# EAGLE design DDB Power Supply (EAGLE 8.2.2)
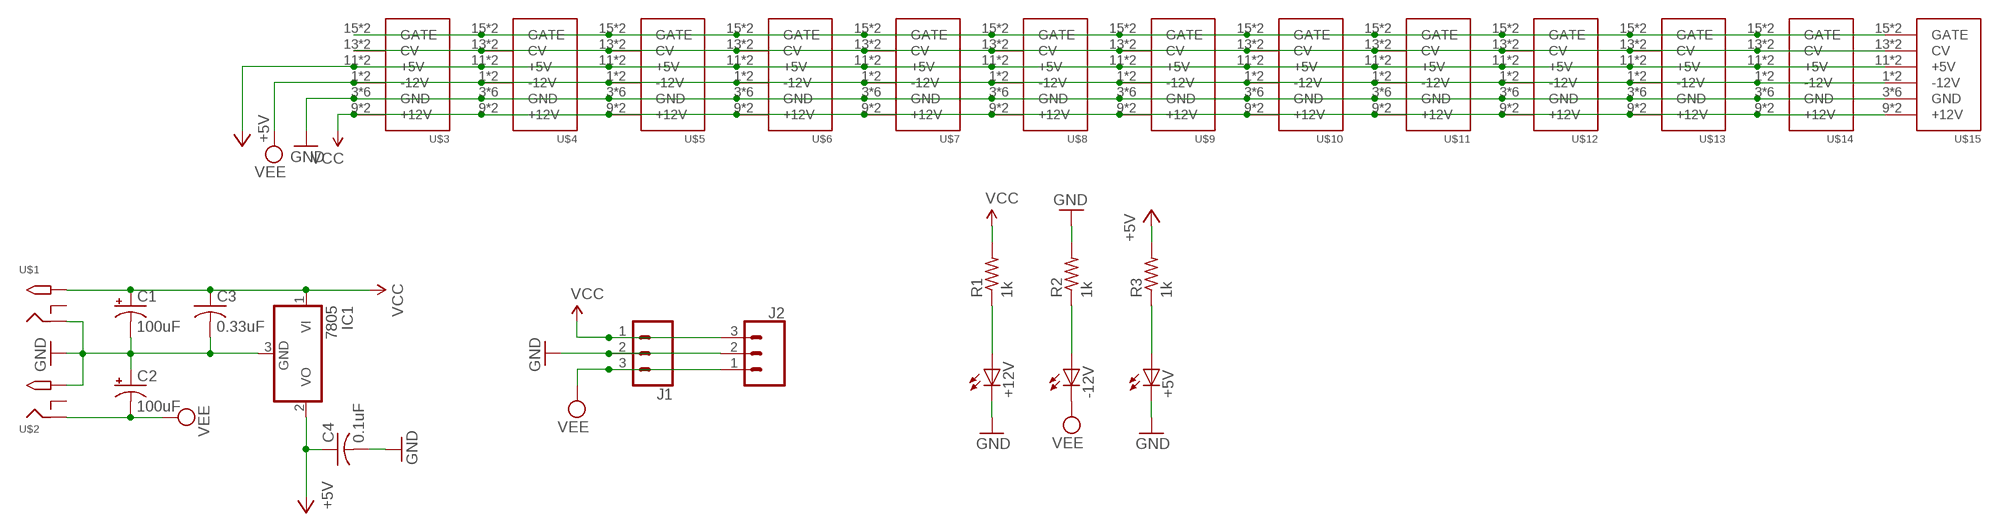
[diagram p0: schematic, sheet 1]

## Parts
+5V  LED3MM  [LED3MM]
+12V  LED3MM  [LED3MM]
-12V  LED3MM  [LED3MM]
C1  100uF  CPOL-USE3.5-8  [E3,5-8]
C2  100uF  CPOL-USE3.5-8  [E3,5-8]
C3  0.33uF  C-USC0805  [C0805]
C4  0.1uF  C-USC0805  [C0805]
IC1  7805  7824DT  [TO252]
J1  CONN_03SCREW  [SCREWTERMINAL-3.5MM-3]
J2  CONN_03SCREW  [SCREWTERMINAL-3.5MM-3]
R1  1k  R-US_R0805  [R0805]
R2  1k  R-US_R0805  [R0805]
R3  1k  R-US_R0805  [R0805]
U$1  2.1MMJACKTHM  [PJ-102A]
U$2  2.1MMJACKTHM  [PJ-102A]
U$3  POWER  [POWER_16]
U$4  POWER  [POWER_16]
U$5  POWER  [POWER_16]
U$6  POWER  [POWER_16]
U$7  POWER  [POWER_16]
U$8  POWER  [POWER_16]
U$9  POWER  [POWER_16]
U$10  POWER  [POWER_16]
U$11  POWER  [POWER_16]
U$12  POWER  [POWER_16]
U$13  POWER  [POWER_16]
U$14  POWER  [POWER_16]
U$15  POWER  [POWER_16]

## Nets
+5V: C4.1 IC1.2(VO) R3.2 U$3.11(+5V) U$3.12(+5V) U$4.11(+5V) U$4.12(+5V) U$5.11(+5V) U$5.12(+5V) U$6.11(+5V) U$6.12(+5V) U$7.11(+5V) U$7.12(+5V) U$8.11(+5V) U$8.12(+5V) U$9.11(+5V) U$9.12(+5V) U$10.11(+5V) U$10.12(+5V) U$11.11(+5V) U$11.12(+5V) U$12.11(+5V) U$12.12(+5V) U$13.11(+5V) U$13.12(+5V) U$14.11(+5V) U$14.12(+5V) U$15.11(+5V) U$15.12(+5V)
GND: +5V.K(C) +12V.K(C) C1.- C2.+ C3.2 C4.2 IC1.3(GND) J1.2 J2.2 R2.2 U$1.RING U$2.TIP U$3.3(GND) U$3.4(GND) U$3.5(GND) U$3.6(GND) U$3.7(GND) U$3.8(GND) U$4.3(GND) U$4.4(GND) U$4.5(GND) U$4.6(GND) U$4.7(GND) U$4.8(GND) U$5.3(GND) U$5.4(GND) U$5.5(GND) U$5.6(GND) U$5.7(GND) U$5.8(GND) U$6.3(GND) U$6.4(GND) U$6.5(GND) U$6.6(GND) U$6.7(GND) U$6.8(GND) U$7.3(GND) U$7.4(GND) U$7.5(GND) U$7.6(GND) U$7.7(GND) U$7.8(GND) U$8.3(GND) U$8.4(GND) U$8.5(GND) U$8.6(GND) U$8.7(GND) U$8.8(GND) U$9.3(GND) U$9.4(GND) U$9.5(GND) U$9.6(GND) U$9.7(GND) U$9.8(GND) U$10.3(GND) U$10.4(GND) U$10.5(GND) U$10.6(GND) U$10.7(GND) U$10.8(GND) U$11.3(GND) U$11.4(GND) U$11.5(GND) U$11.6(GND) U$11.7(GND) U$11.8(GND) U$12.3(GND) U$12.4(GND) U$12.5(GND) U$12.6(GND) U$12.7(GND) U$12.8(GND) U$13.3(GND) U$13.4(GND) U$13.5(GND) U$13.6(GND) U$13.7(GND) U$13.8(GND) U$14.3(GND) U$14.4(GND) U$14.5(GND) U$14.6(GND) U$14.7(GND) U$14.8(GND) U$15.3(GND) U$15.4(GND) U$15.5(GND) U$15.6(GND) U$15.7(GND) U$15.8(GND)
N$1: U$3.15(GATE) U$3.16(GATE) U$4.15(GATE) U$4.16(GATE) U$5.15(GATE) U$5.16(GATE) U$6.15(GATE) U$6.16(GATE) U$7.15(GATE) U$7.16(GATE) U$8.15(GATE) U$8.16(GATE) U$9.15(GATE) U$9.16(GATE) U$10.15(GATE) U$10.16(GATE) U$11.15(GATE) U$11.16(GATE) U$12.15(GATE) U$12.16(GATE) U$13.15(GATE) U$13.16(GATE) U$14.15(GATE) U$14.16(GATE) U$15.15(GATE) U$15.16(GATE)
N$2: U$3.13(CV) U$3.14(CV) U$4.13(CV) U$4.14(CV) U$5.13(CV) U$5.14(CV) U$6.13(CV) U$6.14(CV) U$7.13(CV) U$7.14(CV) U$8.13(CV) U$8.14(CV) U$9.13(CV) U$9.14(CV) U$10.13(CV) U$10.14(CV) U$11.13(CV) U$11.14(CV) U$12.13(CV) U$12.14(CV) U$13.13(CV) U$13.14(CV) U$14.13(CV) U$14.14(CV) U$15.13(CV) U$15.14(CV)
N$3: +5V.A R3.1
N$4: -12V.A R2.1
N$5: +12V.A R1.1
VCC: C1.+ C3.1 IC1.1(VI) J1.1 J2.3 R1.2 U$1.TIP U$3.9(+12V) U$3.10(+12V) U$4.9(+12V) U$4.10(+12V) U$5.9(+12V) U$5.10(+12V) U$6.9(+12V) U$6.10(+12V) U$7.9(+12V) U$7.10(+12V) U$8.9(+12V) U$8.10(+12V) U$9.9(+12V) U$9.10(+12V) U$10.9(+12V) U$10.10(+12V) U$11.9(+12V) U$11.10(+12V) U$12.9(+12V) U$12.10(+12V) U$13.9(+12V) U$13.10(+12V) U$14.9(+12V) U$14.10(+12V) U$15.9(+12V) U$15.10(+12V)
VEE: -12V.K(C) C2.- J1.3 J2.1 U$2.RING U$3.1(-12V) U$3.2(-12V) U$4.1(-12V) U$4.2(-12V) U$5.1(-12V) U$5.2(-12V) U$6.1(-12V) U$6.2(-12V) U$7.1(-12V) U$7.2(-12V) U$8.1(-12V) U$8.2(-12V) U$9.1(-12V) U$9.2(-12V) U$10.1(-12V) U$10.2(-12V) U$11.1(-12V) U$11.2(-12V) U$12.1(-12V) U$12.2(-12V) U$13.1(-12V) U$13.2(-12V) U$14.1(-12V) U$14.2(-12V) U$15.1(-12V) U$15.2(-12V)
Unconnected: U$1.RING_SW U$2.RING_SW

## Library data of the parts
+5V +12V -12V = adafruit:LED: LED OSRAM: - CHIPLED LG R971, LG N971, LY N971, LG Q971, LY Q971, LO R971, LY R971 LH N974, LH R974 LS Q976, LO Q976, LY Q976 LO Q996 - Hyper CHIPLED LW Q18S LB Q993, LB Q99A, LB R99A - SideLED LS A670, LO A670, LY A670, LG A670, LP A670 LB A673, LV A673, LT A673, LW A673 LH A674 LY A675 LS A676, LA A676, LO A676, LY A676, LW A676 LS A679, LY A679, LG A679 - Hyper Micro SIDELED® LS Y876, LA Y876, LO Y876, LY Y876 LT Y87S - SmartLED LW L88C, LW L88S LB L89C, LB L89S, LG L890 LS L89K, LO L89K, LY L89K LS L896, LA L896, LO L896, LY L896 - TOPLED LS T670, LO T670, LY T670, LG T670, LP T670 LSG T670, LSP T670, LSY T670, LOP T670, LYG T670 LG T671, LOG T671, LSG T671 LB T673, LV T673, LT T673, LW T673 LH T674 LS T676, LA T676, LO T676, LY T676, LB T676, LH T676, LSB T676, LW T676 LB T67C, LV T67C, LT T67C, LS T67K, LO T67K, LY T67K, LW E67C LS E67B, LA E67B, LO E67B, LY E67B, LB E67C, LV E67C, LT E67C LW T67C LS T679, LY T679, LG T679 LS T770, LO T770, LY T770, LG T770, LP T770 LB T773, LV T773, LT T773, LW T773 LH T774 LS E675, LA E675, LY E675, LS T675 LS T776, LA T776, LO T776, LY T776, LB T776 LHGB T686 LT T68C, LB T68C - Hyper Mini TOPLED® LB M676 - Mini TOPLED Santana® LG M470 LS M47K, LO M47K, LY M47K Source: http://www.osram.convergy.de/
C1 C2 = adafruit:CPOL-US: POLARIZED CAPACITOR, American symbol
C3 C4 = adafruit:C-US: CAPACITOR, American symbol
IC1 = adafruit:78*: Positive VOLTAGE REGULATOR Added bigger pads to the TO-92 package
J1 J2 = SparkFun-Connectors:CONN_03: Multi connection point. Often used as Generic Header-pin footprint for 0.1 inch spaced/style header connections On any of the 0.1 inch spaced packages, you can populate with these: Break Away Headers - Straight <https://www.sparkfun.com/products/116> (PRT-00116) Break Away Male Headers - Right Angle <https://www.sparkfun.com/products/553> (PRT-00553) Female Headers <https://www.sparkfun.com/products/115> (PRT-00115) Break Away Headers - Machine Pin <https://www.sparkfun.com/products/117> (PRT-00117) Break Away Female Headers - Swiss Machine Pin <https://www.sparkfun.com/products/743> (PRT-00743) Stackable Header - 3 Pin (Female, 0.1") <https://www.sparkfun.com/products/13875> (PRT-13875) For SCREWTERMINALS and SPRING TERMINALS visit here: Screw Terimnals on SparkFun.com <https://www.sparkfun.com/search/results?term=Screw+Terminals> (5mm/3.5mm/2.54mm spacing) This device is also useful as a general connection point to wire up your design to another part of your project. Our various solder wires solder well into these plated through hole pads. Hook-Up Wire - Assortment (Stranded, 22 AWG) <https://www.sparkfun.com/products/11375> (PRT-11375) Hook-Up Wire - Assortment (Solid Core, 22 AWG) <https://www.sparkfun.com/products/11367> (PRT-11367) View the entire wire category on our website here <https://www.sparkfun.com/categories/141> Special notes: Molex polarized connector foot print use with SKU : PRT-08232 with associated crimp pins and housings.; PROD_ID: CONN-08288; SF_ID: PRT-08235
R1-R3 = resistor:R-US_: RESISTOR, American symbol
U$1 U$2 = adafruit:2.1MMJACK: 2.1mm x 5.5mm THM DC jack with internal switch. Digikey part #PJ-102A, 4UCON part #05537 2.1mm x 5.5mm SMT DC jack with internal switch. Digikey part #PJ-002A-SMT, 4UCON part #03267 By microbuilder.eu & adafruit.com
U$3-U$15 = eurorack power:POWER

## Board
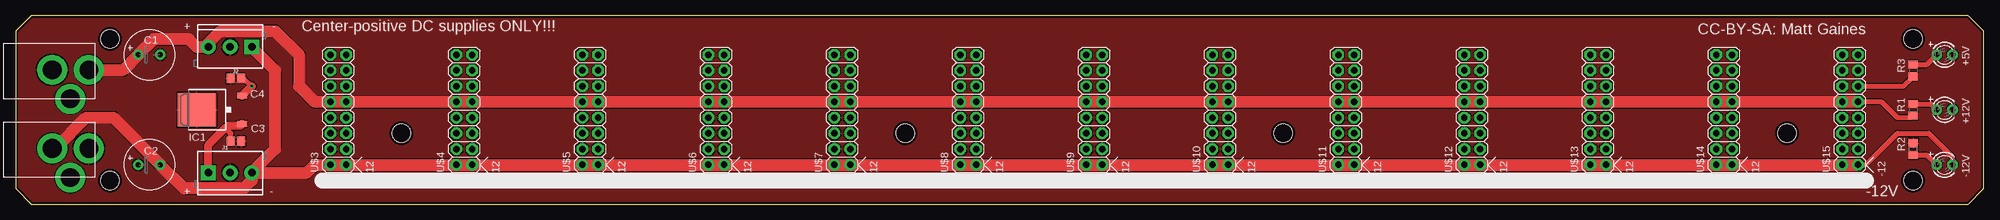
[diagram p1: board, top side]
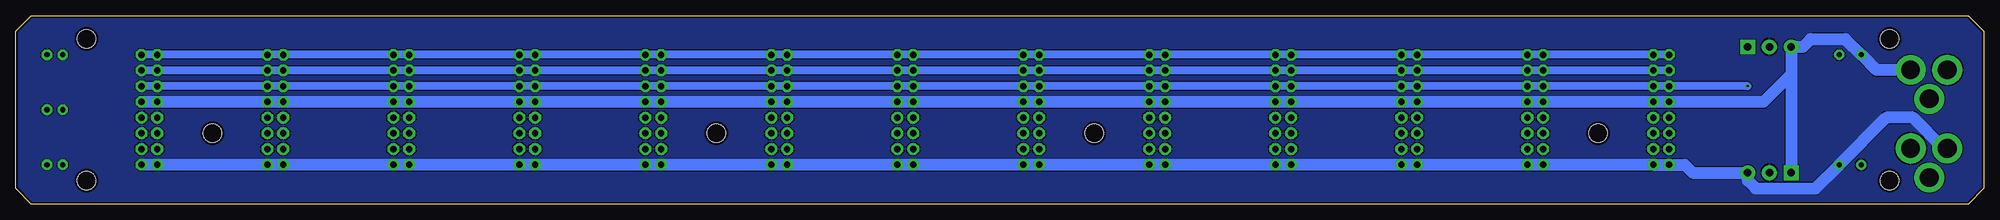
[diagram p2: board, bottom side, seen from below]

Size 317.5 x 30.48 mm. Coordinates in mm from the lower left corner, seen from the top.
Outline: 0,2.54 2.54,0 314.96,0 317.5,2.54 317.5,27.94 314.96,30.48 2.54,30.48 0,27.94 0,2.54
Copper layers (1*16): Top 0.0356mm / dielectric 1.5011mm / Bottom 0.0356mm
Design rules "oshpark-2layer": minimum track width 6mil, minimum drill 13mil, track to track 6mil, track to pad 6mil, pad to pad 6mil, via to via 6mil, smd to smd 6mil, copper to edge 15mil, drill to drill 6mil, minimum pad ring 7mil, minimum via ring 7mil, stop-mask expansion 2.5mil, vias tented up to drill 0mil, thermal gap 10mil
Holes 3.01 mm at 62.23,11.43 285.75,11.43 15.24,3.81 143.51,11.43 204.47,11.43 15.24,26.67 306.07,3.81 306.07,26.67

### Footprints (pad centres in the part's own frame; a part is rotated, then mirrored left to right if it is on the bottom)
LED3MM = drill 0.813 pad 1.676 octagon: A -1.27,0; K 1.27,0
E3,5-8 = drill 0.813 pad 1.6: + -1.778,0 | drill 0.813 pad 1.6 octagon: - 1.778,0
C0805 = smd 1.3 x 1.5: 1 -0.85,0; 2 0.85,0
TO252 = smd 1 x 1.6: 1 -2.28,-4.8; 2 2.28,-4.8 | smd 5.4 x 6.2: 3 0,2.5
SCREWTERMINAL-3.5MM-3 = drill 1.2 pad 2.413 square: 1 0,0 | drill 1.2 pad 2.413: 2 3.5,0; 3 7,0
R0805 = smd 1.3 x 1.5: 1 -0.95,0; 2 0.95,0
PJ-102A = drill 3 pad 4.8: RING 0.1,-3.39; RING_SW -4.6,-6.29; TIP 0.1,-9.29
POWER_16 = drill 1.016 pad 1.88 octagon: 1 -6.35,-1.27; 2 -6.35,1.27; 3 -3.81,-1.27; 4 -3.81,1.27; 5 -1.27,-1.27; 6 -1.27,1.27; 7 1.27,-1.27; 8 1.27,1.27; 9 3.81,-1.27; 10 3.81,1.27; 11 6.35,-1.27; 12 6.35,1.27; 13 8.89,-1.27; 14 8.89,1.27; 15 11.43,-1.27; 16 11.43,1.27

### Placement (x,y rotation side)
+5V  311.15,24.13 0 top
+12V  311.15,15.24 0 top
-12V  311.15,6.35 0 top
C1  21.59,24.13 0 top
C2  21.59,6.35 0 top
C3  35.56,10.16 0 top
C4  35.56,20.32 180 top
IC1  31.75,15.24 90 top
J1  31.11,5.08 0 top
J2  38.1,25.4 180 top
R1  306.07,15.24 270 top
R2  306.07,8.89 90 top
R3  306.07,21.59 270 top
U$1  2.54,21.59 90 top
U$2  2.54,8.89 90 top
U$3  52.07,12.7 90 top
U$4  72.39,12.7 90 top
U$5  92.71,12.7 90 top
U$6  113.03,12.7 90 top
U$7  133.35,12.7 90 top
U$8  153.67,12.7 90 top
U$9  173.99,12.7 90 top
U$10  194.31,12.7 90 top
U$11  214.63,12.7 90 top
U$12  234.95,12.7 90 top
U$13  255.27,12.7 90 top
U$14  275.59,12.7 90 top
U$15  295.91,12.7 90 top

### Tracks (layer width: path | path; a pad name or v marks a point on that pad's centre or on a via)
+5V  (via drill 0.35)
  Top 0.813: C4.1 36.83,20.32 v38.1,19.05 | U$15.11 304.48,19.05 R3.2
  Top 1.27: IC1.2 36.57,17.52 v38.1,19.05
  Bottom 1.27: v38.1,19.05 U$3.12 U$3.11 U$4.12 U$4.11 U$5.12 U$5.11 U$6.12 U$6.11 U$7.12 U$7.11 U$8.12 U$8.11 U$9.12 U$9.11 U$10.12 U$10.11 U$11.12 U$11.11 U$12.12 U$12.11 U$13.12 U$13.11 U$14.12 U$14.11 U$15.12 U$15.11
GND
  pour Top: -1.27,31.75 -1.27,-2.54 325.12,-2.54 325.12,31.75
  pour Bottom: -2.54,31.75 -2.54,-5.08 323.85,-5.08 323.85,33.02 0,34.29
N$1
  Bottom 1.27: U$3.16 U$3.15 U$4.16 U$4.15 U$5.16 U$5.15 U$6.16 U$6.15 U$7.16 U$7.15 U$8.16 U$8.15 U$9.16 U$9.15 U$10.16 U$10.15 U$11.16 U$11.15 U$12.16 U$12.15 U$13.16 U$13.15 U$14.16 U$14.15 U$15.16 U$15.15
N$2
  Bottom 1.27: U$3.14 U$3.13 U$4.14 U$4.13 U$5.14 U$5.13 U$6.14 U$6.13 U$7.14 U$7.13 U$8.14 U$8.13 U$9.14 U$9.13 U$10.14 U$10.13 U$11.14 U$11.13 U$12.14 U$12.13 U$13.14 U$13.13 U$14.14 U$14.13 U$15.14 U$15.13
N$3
  Top 0.813: R3.1 308.29,22.54 +5V.A
N$4
  Top 0.813: R2.1 308.29,7.94 -12V.A
N$5
  Top 0.813: R1.1 308.93,16.19 +12V.A
VCC
  Top 0.813: C3.1 34.71,11.42 33.86,12.27 | U$15.9 300.99,16.51 303.53,13.97 305.75,13.97 R1.2
  Top 1.27: J1.1 31.11,9.53 33.86,12.27 34.29,12.7 36.29,12.7 IC1.1
  Top 1.905: U$1.TIP 17.37,21.69 C1.+ 22.35,26.67 27.94,26.67 29.21,25.4 J2.3 31.1,26.02 33.02,27.94 41.91,27.94 45.72,24.13 45.72,19.05 48.26,16.51 U$3.10 U$3.9 U$4.10 U$4.9 U$5.10 U$5.9 U$6.10 U$6.9 U$7.10 U$7.9 U$8.10 U$8.9 U$9.10 U$9.9 U$10.10 U$10.9 U$11.10 U$11.9 U$12.10 U$12.9 U$13.10 U$13.9 U$14.10 U$14.9 U$15.10 U$15.9
  Bottom 1.905: U$15.9 U$15.10 U$14.9 U$14.10 U$13.9 U$13.10 U$12.9 U$12.10 U$11.9 U$11.10 U$10.9 U$10.10 U$9.9 U$9.10 U$8.9 U$8.10 U$7.9 U$7.10 U$6.9 U$6.10 U$5.9 U$5.10 U$4.9 U$4.10 U$3.9 U$3.10 35.56,16.51 31.1,20.97 | U$1.TIP 17.37,21.69 C1.+ 22.35,26.67 27.94,26.67 29.21,25.4 J2.3 31.1,20.97 | 31.1,20.97 31.1,5.09 J1.1
VEE
  Top 0.813: U$15.1 298.45,6.35 303.53,11.43 308.61,11.43 312.42,7.62 -12V.K
  Top 1.905: J1.3 38.12,5.09 41.91,8.89 41.91,21.59 J2.1 | J1.3 38.12,3.83 36.83,2.54 27.18,2.54 C2.- 15.75,13.97 11.43,13.97 6.45,8.99 U$2.RING | J1.3 46.99,5.08 48.26,6.35 U$3.2 U$3.1 U$4.2 U$4.1 U$5.2 U$5.1 U$6.2 U$6.1 U$7.2 U$7.1 U$8.2 U$8.1 U$9.2 U$9.1 U$10.2 U$10.1 U$11.2 U$11.1 U$12.2 U$12.1 U$13.2 U$13.1 U$14.2 U$14.1 U$15.2 U$15.1
  Bottom 1.905: U$15.1 U$15.2 U$14.1 U$14.2 U$13.1 U$13.2 U$12.1 U$12.2 U$11.1 U$11.2 U$10.1 U$10.2 U$9.1 U$9.2 U$8.1 U$8.2 U$7.1 U$7.2 U$6.1 U$6.2 U$5.1 U$5.2 U$4.1 U$4.2 U$3.1 U$3.2 48.26,6.35 46.99,5.08 J1.3 38.12,3.83 36.83,2.54 27.18,2.54 C2.- 15.75,13.97 11.43,13.97 6.45,8.99 U$2.RING

### Text on the board
tNames: CC-BY-SA: Matt Gaines | + | - | Center-positive DC supplies ONLY!!! | + | - | -12V